# Altium schematic sheet TC_switch_to_shield_connection.SchDoc
size A4
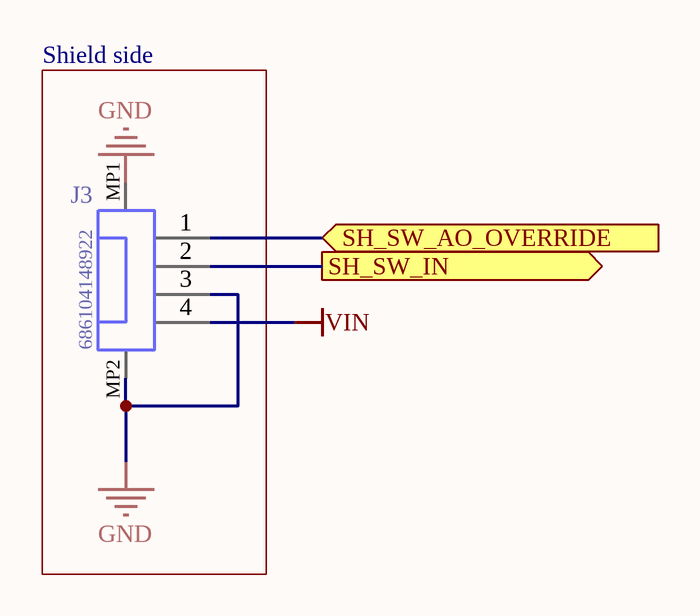
[diagram p0: TC_switch_to_shield_connection.SchDoc]

## Parts
J3  686104148922  [686104148922]

## Blocks framed on the sheet
Shield side: J3

## Ports
SH_SW_AO_OVERRIDE (in), SH_SW_IN (out)

## Nets
GND: J3.3 J3.MP1 J3.MP2
VIN: J3.4
SH_SW_AO_OVERRIDE: J3.1 ; port SH_SW_AO_OVERRIDE
SH_SW_IN: J3.2 ; port SH_SW_IN

## Library data of the parts
J3 = CMP-1502-01512-1: SMT ZIF Connectors Hinge Type WR-FPC, Horizontal, Bottom Contact, pitch 1 mm, 4 pins; Manufacturer: Wurth Elektronik; Contact Resistance: 50mOhm; Withstanding Voltage: 500VAC; Working Voltage: 100VAC; Pitch: 1mm; Rated Current: 1A; Pin Number: 4; Operating Temperature: -40to105degC; Part Number: 686104148922; Packaging: TapeandReel; Package Reference: 686104148922; Datasheet URL: https://katalog.we-online.de/em/datasheet/686104148922.pdf; Mounting Technology: SMT; Manufacturer URL: http://www.we-online.de; Contact Design: BottomContact; Orientation: Horizontal; Publisher: WurthElektronik